# EAGLE design LaserGatesDetector (EAGLE 9.6.2)
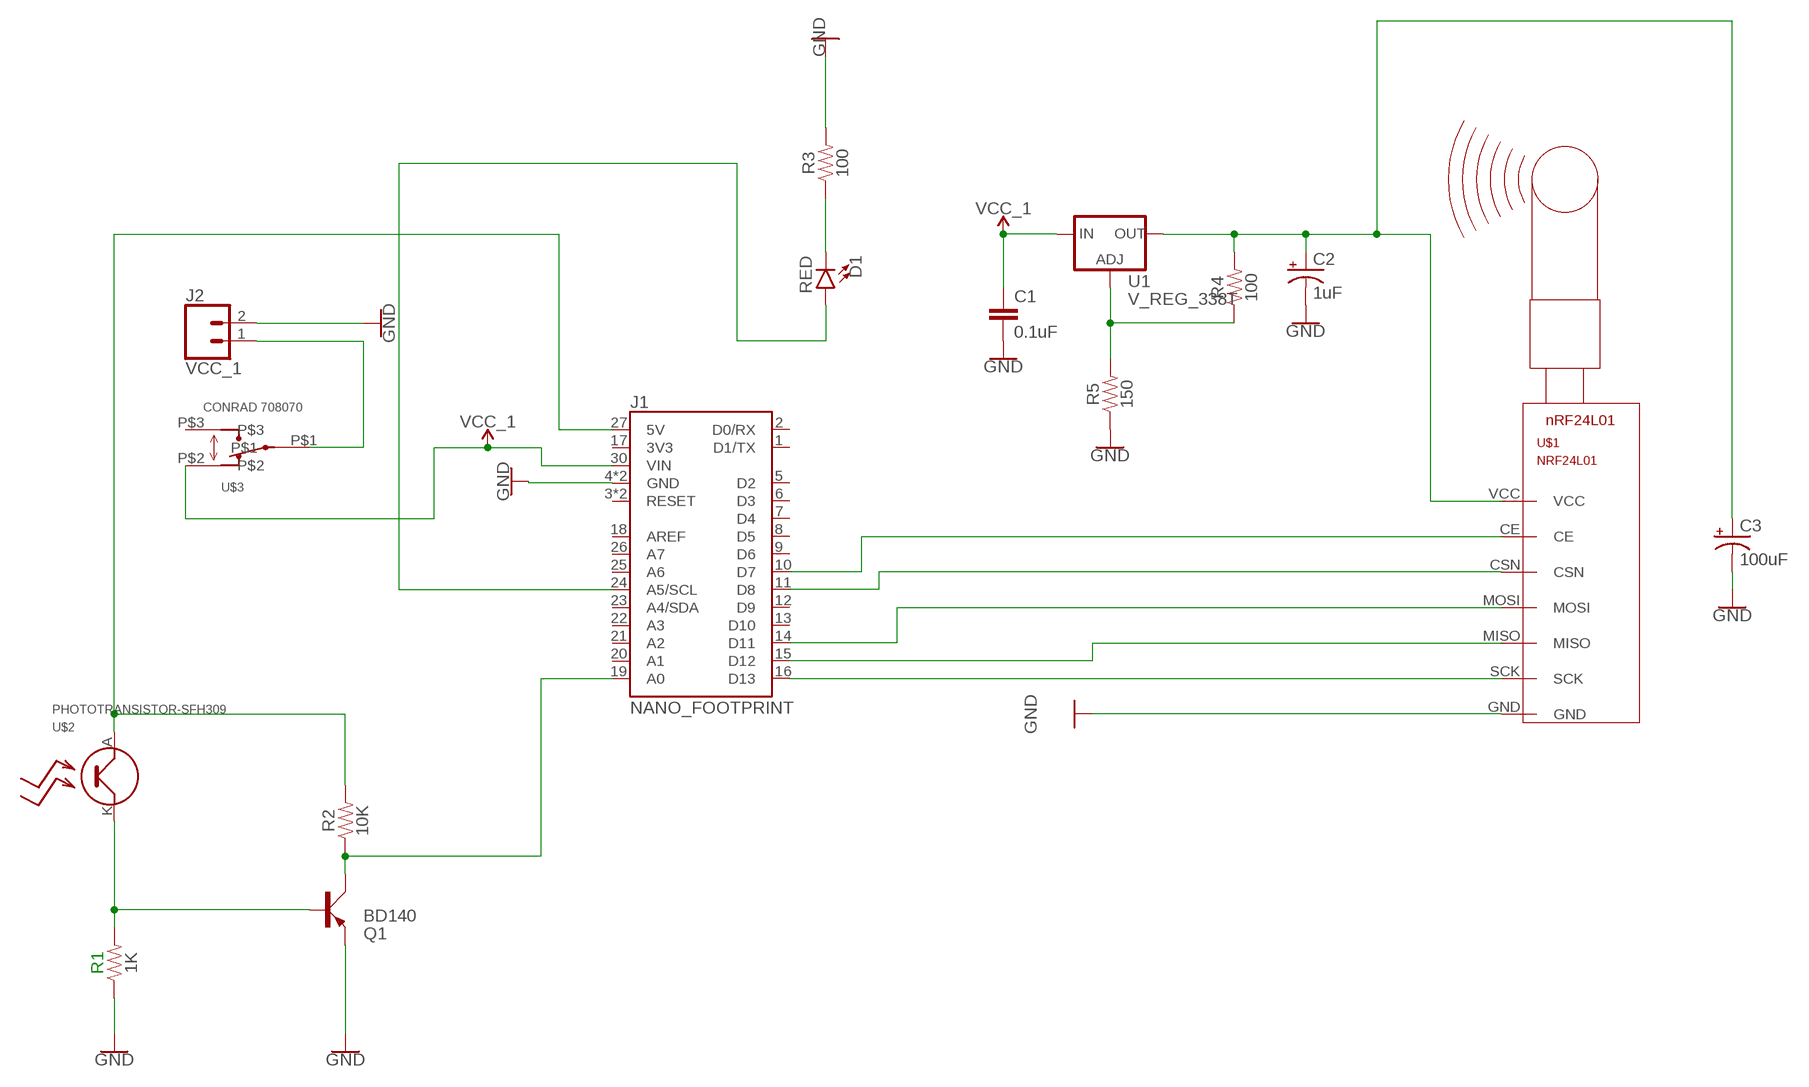
[diagram p0: schematic, sheet 1]

## Parts
C1  0.1uF  0.1UF-KIT-EZ-50V-20%  [CAP-PTH-SMALL-KIT]
C2  1uF  10UF-POLAR-RADIAL-2.5MM-25V-20%  [CPOL-RADIAL-2.5MM-5MM]
C3  100uF  1000UF-RADIAL-5MM-25V-20%  [CPOL-RADIAL-5MM-10MM]
D1  RED  LED5MM-KIT  [LED_5MM-KIT]
J1  NANO_FOOTPRINT  [NANO]
J2  VCC_1  CONN_02  [1X02]
Q1  BD140  [TO126AV]
R1  1K  1MOHM-HORIZ-1/4W-5%  [AXIAL-0.3]
R2  10K  1MOHM-HORIZ-1/4W-5%  [AXIAL-0.3]
R3  100  100OHM-HORIZ-1/4W-1%  [AXIAL-0.3]
R4  100  1KOHM-HORIZ-1/4W-1%  [AXIAL-0.3]
R5  150  1KOHM-HORIZ-1/4W-1%  [AXIAL-0.3]
U1  V_REG_338T  V_REG_317SINK  [TO220-ADJ]
U$1  NRF24L01  [NRF24L01]
U$2  PHOTOTRANSISTOR-SFH309  [SFH]
U$3  SLIDE-SWITCH-CONRAD708070  [SLIDE-SWITCH-CONRAD708070]

## Nets
GND: C1.2 C2.2(-) C3.- J1.4(GND) J1.29(GND) J2.2 Q1.E R1.P$1 R3.P$2 R5.P$1 U$1.GND
N$1: J1.11(D8) U$1.CSN
N$2: J1.10(D7) U$1.CE
N$3: J1.16(D13) U$1.SCK
N$4: J1.14(D11) U$1.MOSI
N$5: J1.15(D12) U$1.MISO
N$6: Q1.B R1.P$2 U$2.K(K$1)
N$8: D1.A J1.24(A5/SCL)
N$9: D1.K(C) R3.P$1
N$10: J2.1 U$3.P$1
N$11: J1.27(5V) R2.P$2 U$2.A(A$1)
N$12: J1.19(A0) Q1.C R2.P$1
N$13: R4.P$1 R5.P$2 U1.ADJ
N$14: C2.1(+) C3.+ R4.P$2 U1.OUT U$1.VCC
VCC_1: C1.1 J1.30(VIN) U1.IN U$3.P$2
Unconnected: J1.1(D1/TX) J1.2(D0/RX) J1.3(RESET) J1.5(D2) J1.6(D3) J1.7(D4) J1.8(D5) J1.9(D6) J1.12(D9) J1.13(D10) J1.17(3V3) J1.18(AREF) J1.20(A1) J1.21(A2) J1.22(A3) J1.23(A4/SDA) J1.25(A6) J1.26(A7) J1.28(RESET) U$3.P$3

## Library data of the parts
C1 = SparkFun-Capacitors:0.1UF: 0.1µF ceramic capacitors A capacitor is a passive two-terminal electrical component used to store electrical energy temporarily in an electric field.; PROD_ID: CAP-08370
C2 = SparkFun-Capacitors:10UF-POLAR: 10.0µF polarized capacitors A capacitor is a passive two-terminal electrical component used to store electrical energy temporarily in an electric field.; PROD_ID: CAP-08440; VALUE: 10uF
C3 = SparkFun-Capacitors:1000UF: 1,000µF/1mF ceramic capacitors A capacitor is a passive two-terminal electrical component used to store electrical energy temporarily in an electric field. CAP-08070; PROD_ID: CAP-09538; VALUE: 1mF
D1 = SparkFun-LED:LED: LED (Generic) Standard schematic elements and footprints for 5mm, 3mm, 1206, and 0603 sized LEDs. Generic LEDs with no color specified.
J1 = SparkFun-Boards:NANO_FOOTPRINT: Generic Nano Footprint
J2 = SparkFun-Connectors:CONN_02: Multi connection point. Often used as Generic Header-pin footprint for 0.1 inch spaced/style header connections On any of the 0.1 inch spaced packages, you can populate with these: Break Away Headers - Straight <https://www.sparkfun.com/products/116> (PRT-00116) Break Away Male Headers - Right Angle <https://www.sparkfun.com/products/553> (PRT-00553) Female Headers <https://www.sparkfun.com/products/115> (PRT-00115) Break Away Headers - Machine Pin <https://www.sparkfun.com/products/117> (PRT-00117) Break Away Female Headers - Swiss Machine Pin <https://www.sparkfun.com/products/743> (PRT-00743) For SCREWTERMINALS and SPRING TERMINALS visit here: Screw Terimnals on SparkFun.com <https://www.sparkfun.com/search/results?term=Screw+Terminals> (5mm/3.5mm/2.54mm spacing) This device is also useful as a general connection point to wire up your design to another part of your project. Our various solder wires solder well into these plated through hole pads. Hook-Up Wire - Assortment (Stranded, 22 AWG) <https://www.sparkfun.com/products/11375> (PRT-11375) Hook-Up Wire - Assortment (Solid Core, 22 AWG) <https://www.sparkfun.com/products/11367> (PRT-11367) View the entire wire category on our website here <https://www.sparkfun.com/categories/141> Special notes: Molex polarized connector foot print use with: PRT-08233 with associated crimp pins and housings. 2.54_SCREWTERM for use with PRT-10571. 3.5mm Screw Terminal footprints for PRT-08084 5mm Screw Terminal footprints for use with PRT-08432
Q1 = transistor-power:BD140: PNP TRANSISTOR
R1 R2 = SparkFun-Resistors:1MOHM: 1MΩ resistor A resistor is a passive two-terminal electrical component that implements electrical resistance as a circuit element. Resistors act to reduce current flow, and, at the same time, act to lower voltage levels within circuits. - Wikipedia; PROD_ID: RES-09329; VALUE: 1M
R3 = SparkFun-Resistors:100OHM: 100Ω resistor A resistor is a passive two-terminal electrical component that implements electrical resistance as a circuit element. Resistors act to reduce current flow, and, at the same time, act to lower voltage levels within circuits. - Wikipedia; PROD_ID: RES-12181
R4 R5 = SparkFun-Resistors:1KOHM: 1kΩ resistor A resistor is a passive two-terminal electrical component that implements electrical resistance as a circuit element. Resistors act to reduce current flow, and, at the same time, act to lower voltage levels within circuits. - Wikipedia; PROD_ID: RES-12182; VALUE: 1k
U1 = SparkFun-IC-Power:V_REG_317: Voltage Regulator Standard LM317 adjustable voltage regulator. AOI (Adjust Output Input). Google 'LM317 Calculator' for easy to use app to get the two resistor values needed. 240/720 for 5V output. 240/390 for 3.3V output. Spark Fun Electronics SKU : COM-00527
U$1 = Clean-Kong:NRF24L01: nrF54L01 2.4GHz with 100 Channels Emitter/Reveiver SPI Controlled Roboshop / Minint
U$2 = Clean-Kong:PHOTOTRANSISTOR-SFH309
U$3 = Clean-Kong:SLIDE-SWITCH-CONRAD708070

## Board
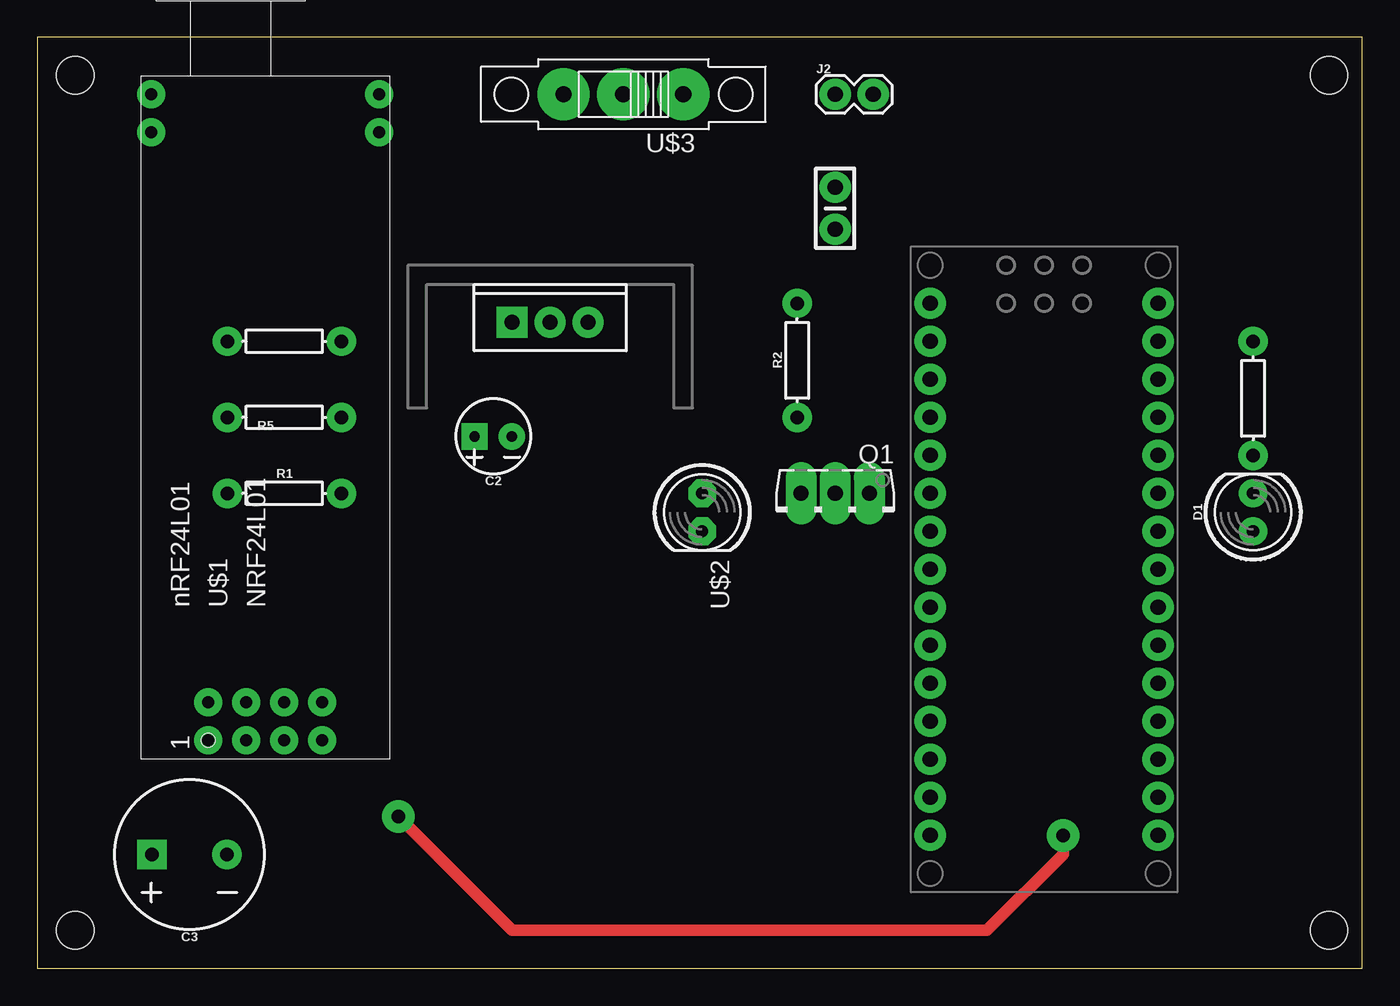
[diagram p1: board, top side]
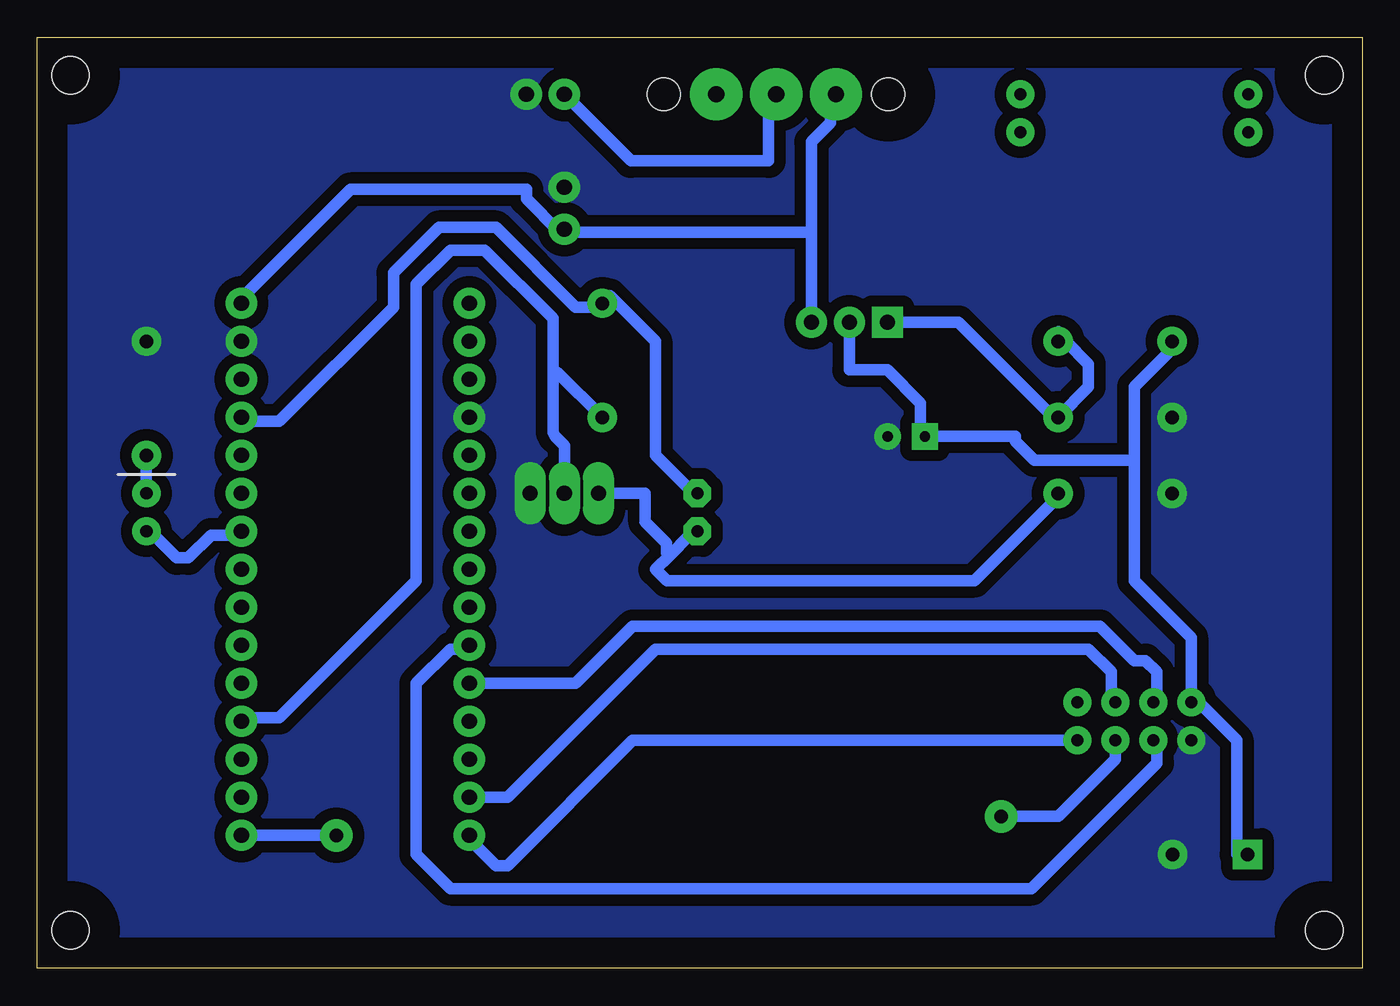
[diagram p2: board, bottom side, seen from below]

Size 88.57 x 62.22 mm. Coordinates in mm from the lower left corner, seen from the top.
Outline: 0,0 88.57,0 88.57,62.22 0,62.22 0,0
Copper layers (1*16): Top 0.035mm / dielectric 1.5mm / Bottom 0.035mm
Design rules "mydesignrules *": minimum track width 30mil, minimum drill 0.9mm, track to track 30mil, track to pad 30mil, pad to pad 30mil, via to via 30mil, smd to smd 20mil, copper to edge 80mil, drill to drill 20mil, minimum pad ring 21mil, minimum via ring 25mil, stop-mask expansion 4mil, vias tented up to drill 0mil, thermal gap 0mil
Holes 2.5 mm at 2.54,59.69 2.54,2.54 86.36,2.54 86.36,59.69

### Footprints (pad centres in the part's own frame; a part is rotated, then mirrored left to right if it is on the bottom)
CAP-PTH-SMALL-KIT = drill 1.016 pad 2.032: 1 -1.397,0; 2 1.397,0
CPOL-RADIAL-2.5MM-5MM = drill 0.7 pad 1.651 square: 1 1.25,0 | drill 0.7 pad 1.651: 2 -1.25,0
CPOL-RADIAL-5MM-10MM = drill 0.9 pad 1.93 square: + 2.5,0 | drill 0.9 pad 1.93: - -2.5,0
LED_5MM-KIT = drill 0.813 pad 1.88: A -1.27,0; K 1.27,0
NANO = drill 1.016: 1 -7.62,17.78; 2 -7.62,15.24; 3 -7.62,12.7; 4 -7.62,10.16; 5 -7.62,7.62; 6 -7.62,5.08; 7 -7.62,2.54; 8 -7.62,0; 9 -7.62,-2.54; 10 -7.62,-5.08; 11 -7.62,-7.62; 12 -7.62,-10.16; 13 -7.62,-12.7; 14 -7.62,-15.24; 15 -7.62,-17.78; 16 7.62,-17.78; 17 7.62,-15.24; 18 7.62,-12.7; 19 7.62,-10.16; 20 7.62,-7.62; 21 7.62,-5.08; 22 7.62,-2.54; 23 7.62,0; 24 7.62,2.54; 25 7.62,5.08; 26 7.62,7.62; 27 7.62,10.16; 28 7.62,12.7; 29 7.62,15.24; 30 7.62,17.78
1X02 = drill 1.016 pad 1.88: 1 0,0; 2 2.54,0
TO126AV = drill 1.016 long: B 2.286,-1.27; C 0,-1.27; E -2.286,-1.27
AXIAL-0.3 = drill 0.9 pad 1.88: P$1 -3.81,0; P$2 3.81,0
TO220-ADJ = drill 1 pad 1.88 square: ADJ -2.54,0 | drill 1 pad 1.88: IN 2.54,0; OUT 0,0
NRF24L01 = drill 0.8 pad 1.676: CE 0,-2.54; CSN 2.54,-2.54; GND 0,0; MISO 0,-7.62; MOSI 2.54,-5.08; P$1 40.64,-11.43; P$2 43.18,-11.43; P$3 43.18,3.81; P$4 40.64,3.81; P$8 2.54,-7.62; SCK 0,-5.08; VCC 2.54,0
SFH = drill 0.8 pad 1.676 octagon: A 0,0; K 2.54,0
SLIDE-SWITCH-CONRAD708070 = drill 1.1 pad 3.5: P$1 4,0; P$2 8,0; P$3 0,0 | hole 2.2: -3.5,0; 11.5,0

### Placement (x,y rotation side)
C1  53.34,50.8 90 top
C2  30.48,35.56 180 top
C3  10.16,7.62 180 top
D1  81.28,30.48 90 top
J1  67.31,26.67 0 top
J2  53.34,58.42 0 top
Q1  53.34,30.48 180 top
R1  16.51,31.75 0 top
R2  50.8,40.64 90 top
R3  81.28,38.1 90 top
R4  16.51,41.91 180 top
R5  16.51,36.83 0 top
U1  34.29,43.18 0 top
U$1  11.43,15.24 90 top
U$2  44.45,31.75 270 top
U$3  43.18,58.42 180 top

### Tracks (layer width: path | path; a pad name or v marks a point on that pad's centre or on a via)
GND
  pour Bottom: 0,80.01 101.6,80.01 101.6,-12.7 0,-12.7
N$1
  Bottom 0.762: J1.11 52.58,19.05 48.77,22.86 17.53,22.86 15.24,20.57 14.48,20.57 13.72,19.81 13.72,18.29 U$1.CSN
N$2
  Bottom 0.762: U$1.CE 13.72,15.24 13.72,13.72 22.1,5.33 60.96,5.33 63.25,7.62 63.25,19.05 60.96,21.34 60.2,21.34 J1.10
N$3  (via drill 0.9)
  Top 0.762: v24.13,10.16 31.75,2.54 63.5,2.54 68.58,7.62 v68.58,8.89
  Bottom 0.762: U$1.SCK 16.51,13.97 20.32,10.16 v24.13,10.16 | J1.16 v68.58,8.89
N$4
  Bottom 0.762: J1.14 57.15,11.43 47.24,21.34 18.29,21.34 16.76,19.81 16.76,18.29 U$1.MOSI
N$5
  Bottom 0.762: U$1.MISO 48.77,15.24 57.15,6.86 57.91,6.86 59.44,8.38 J1.15
N$6
  Bottom 0.762: 46.32,27.59 47.24,26.67 46.48,25.91 25.91,25.91 20.57,31.24 R1.P$2 | 46.32,27.59 44.96,28.96 U$2.K | Q1.B 47.94,31.75 47.94,29.84 46.51,28.42 46.51,27.78 46.32,27.59
N$8
  Bottom 0.762: D1.A 80.77,28.96 79.25,27.43 78.49,27.43 76.96,28.96 75.44,28.96 J1.24
N$9
  Bottom 0.762: R3.P$1 D1.K
N$10
  Bottom 0.762: J2.1 48.9,53.98 39.69,53.98 39.69,58.1 39.37,58.42 U$3.P$1
N$11
  Bottom 0.762: U$2.A 44.96,32 47.24,34.29 47.24,41.91 50.29,44.96 R2.P$2 51.05,44.2 52.58,44.2 57.91,49.53 61.72,49.53 64.77,46.48 64.77,44.2 72.39,36.58 74.68,36.58 J1.27
N$12
  Bottom 0.762: 54.1,39.85 54.1,35.81 53.98,35.56 53.34,34.92 Q1.C | 54.1,39.85 54.1,43.43 58.67,48.01 60.96,48.01 63.25,45.72 63.25,25.91 72.39,16.76 74.68,16.76 J1.19 | R2.P$1 53.82,39.85 54.1,39.85
N$13
  Bottom 0.762: 20.32,42.55 R4.P$1 20,42.23 19.81,41.91 18.29,40.39 18.29,38.86 R5.P$2 20.64,36.83 26.99,43.18 U1.ADJ
N$14
  Bottom 0.762: 28.96,35.56 C2.1 | 15.24,33.97 15.24,25.91 11.43,22.1 11.43,18.29 | 15.24,33.97 15.24,38.86 12.95,41.15 12.95,41.91 R4.P$2 | U1.OUT 34.29,40.01 31.75,40.01 29.53,37.78 29.53,36.2 29.21,35.88 C2.1 | C2.1 23.18,35.56 23.18,35.24 21.91,33.97 15.24,33.97 | 11.43,18.29 8.38,15.24 8.38,7.62 C3.+ | 11.43,18.29 U$1.VCC
VCC_1
  Bottom 0.762: 74.68,44.96 J1.30 74.61,45.09 67.63,52.07 55.88,52.07 55.88,51.44 53.66,49.21 C1.1 53.34,49.21 36.83,49.21 | 36.83,49.21 36.83,55.24 35.56,56.52 35.56,58.1 35.24,58.42 U$3.P$2 | 36.83,49.21 U1.IN